# EAGLE design CommunicationBoard (EAGLE 9.6.2)
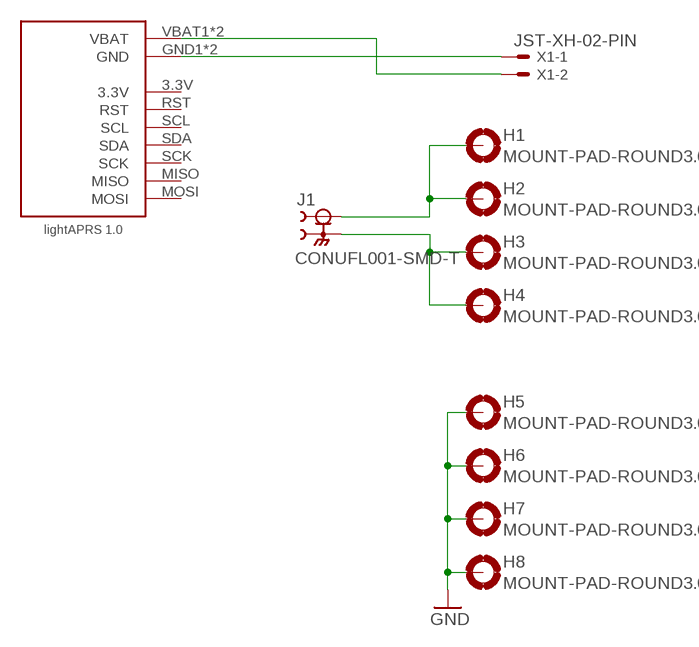
[diagram p0: schematic, sheet 1]

## Parts
H1  MOUNT-PAD-ROUND3.0  [3,0-PAD]
H2  MOUNT-PAD-ROUND3.0  [3,0-PAD]
H3  MOUNT-PAD-ROUND3.0  [3,0-PAD]
H4  MOUNT-PAD-ROUND3.0  [3,0-PAD]
H5  MOUNT-PAD-ROUND3.0  [3,0-PAD]
H6  MOUNT-PAD-ROUND3.0  [3,0-PAD]
H7  MOUNT-PAD-ROUND3.0  [3,0-PAD]
H8  MOUNT-PAD-ROUND3.0  [3,0-PAD]
J1  CONUFL001-SMD-T  [LINX_CONUFL001-SMD-T]
U$1  LIGHTAPRS  [LIGHTAPRS]
X1  JST-XH-02-PIN  [JST-XH_S2B]

## Nets
GND: H5.B3,0(MOUNT) H6.B3,0(MOUNT) H7.B3,0(MOUNT) H8.B3,0(MOUNT) U$1.GND1(GND) U$1.GND2(GND) X1.PIN1
SIG+: H1.B3,0(MOUNT) H2.B3,0(MOUNT) J1.1
SIG-: H3.B3,0(MOUNT) H4.B3,0(MOUNT) J1.2 J1.3
VBAT: U$1.VBAT1(VBAT) U$1.VBAT2(VBAT) X1.PIN2
Unconnected: U$1.3.3V U$1.MISO U$1.MOSI U$1.RST U$1.SCK U$1.SCL U$1.SDA

## Library data of the parts
H1-H8 = holes:MOUNT-PAD-ROUND: MOUNTING PAD, round
J1 = CONUFL001-SMD-T:CONUFL001-SMD-T: Check availability <https://pricing.snapeda.com/parts/CONUFL001-SMD/Linx%20Technologies/view-part?ref=eda>; AVAILABILITY: In Stock; CHECK_PRICES: https://www.snapeda.com/parts/CONUFL001-SMD/Linx+Technologies+Inc./view-part/?ref=eda; DESCRIPTION: MHF1 Straight Surface Mount Jack; MF: Linx Technologies; MP: CONUFL001-SMD; PACKAGE: None; PRICE: None; SNAPEDA_LINK: https://www.snapeda.com/parts/CONUFL001-SMD/Linx+Technologies+Inc./view-part/?ref=snap
U$1 = Breakouts:LIGHTAPRS
X1 = JST-XH Connectors:JST-XH-02-PIN: JST XH Connector 2 Pin Wire to board connector. Pitch: 2,54 mm, (0.100") Number of pins: 2 Created by Rembrandt Electronics www.rembrandtelectronics.com

## Board
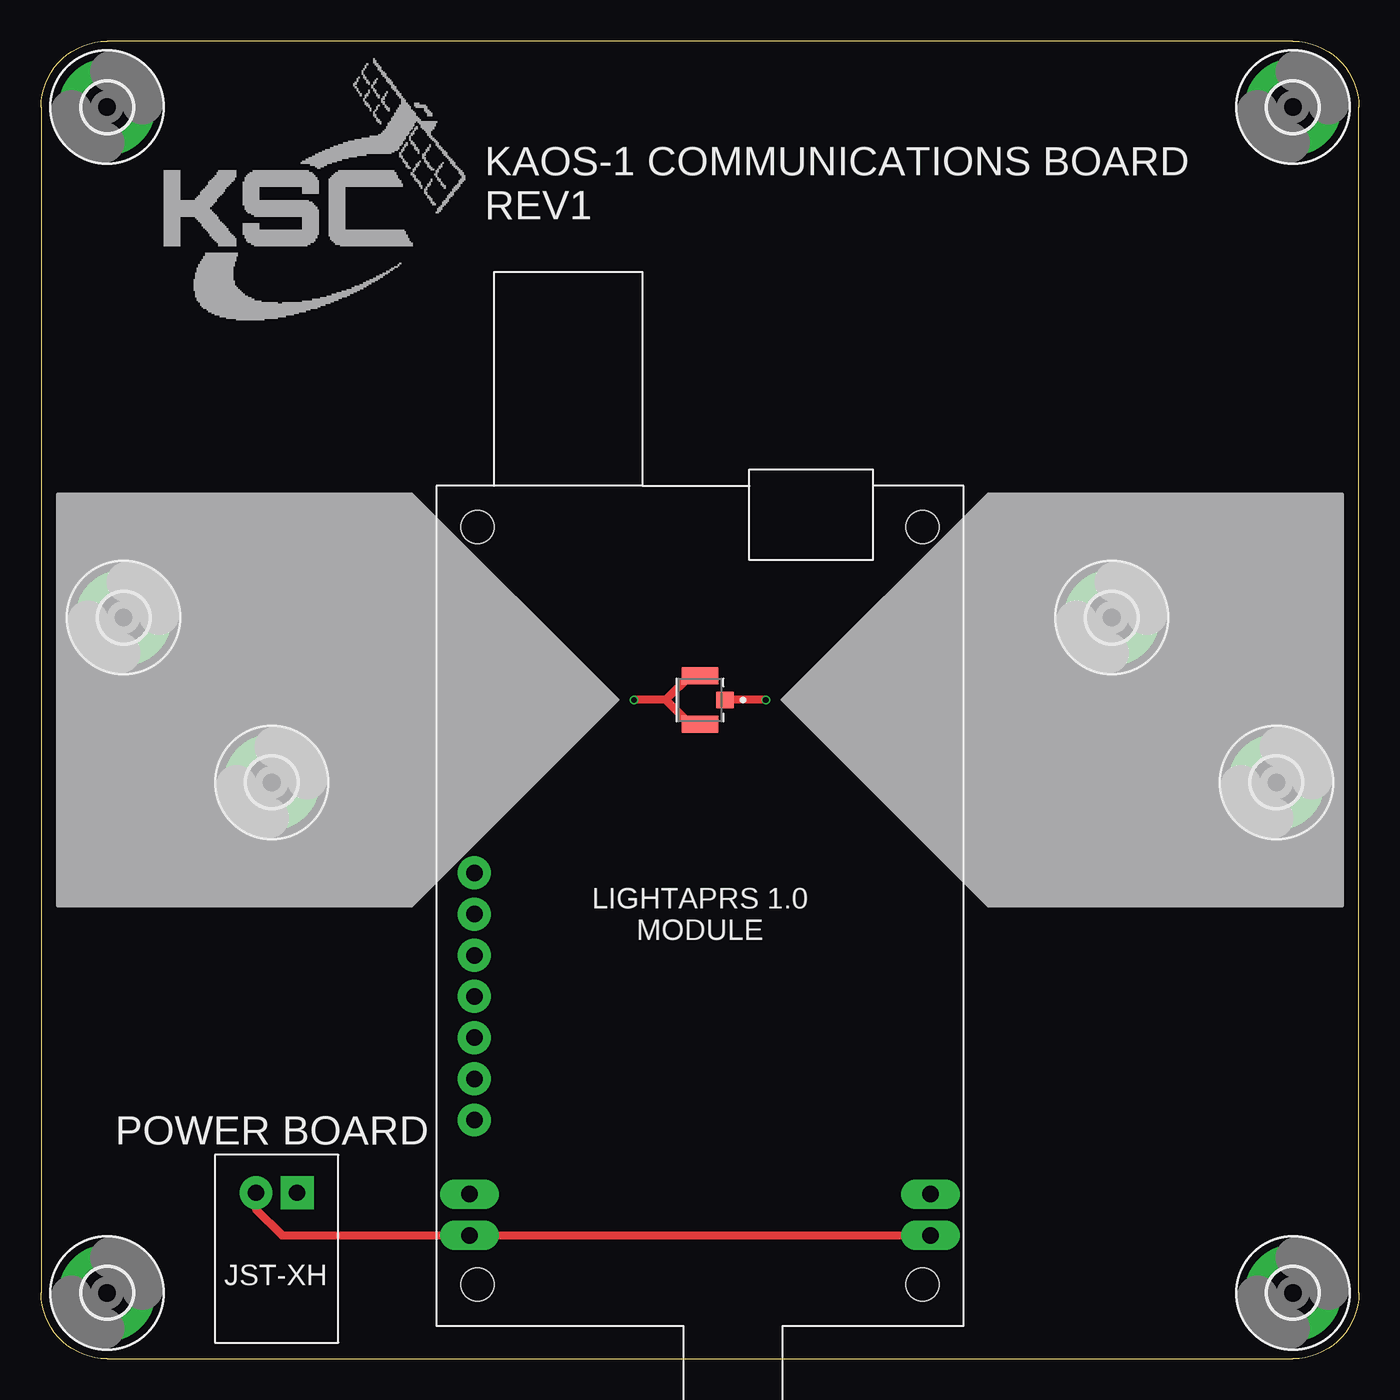
[diagram p1: board, top side]
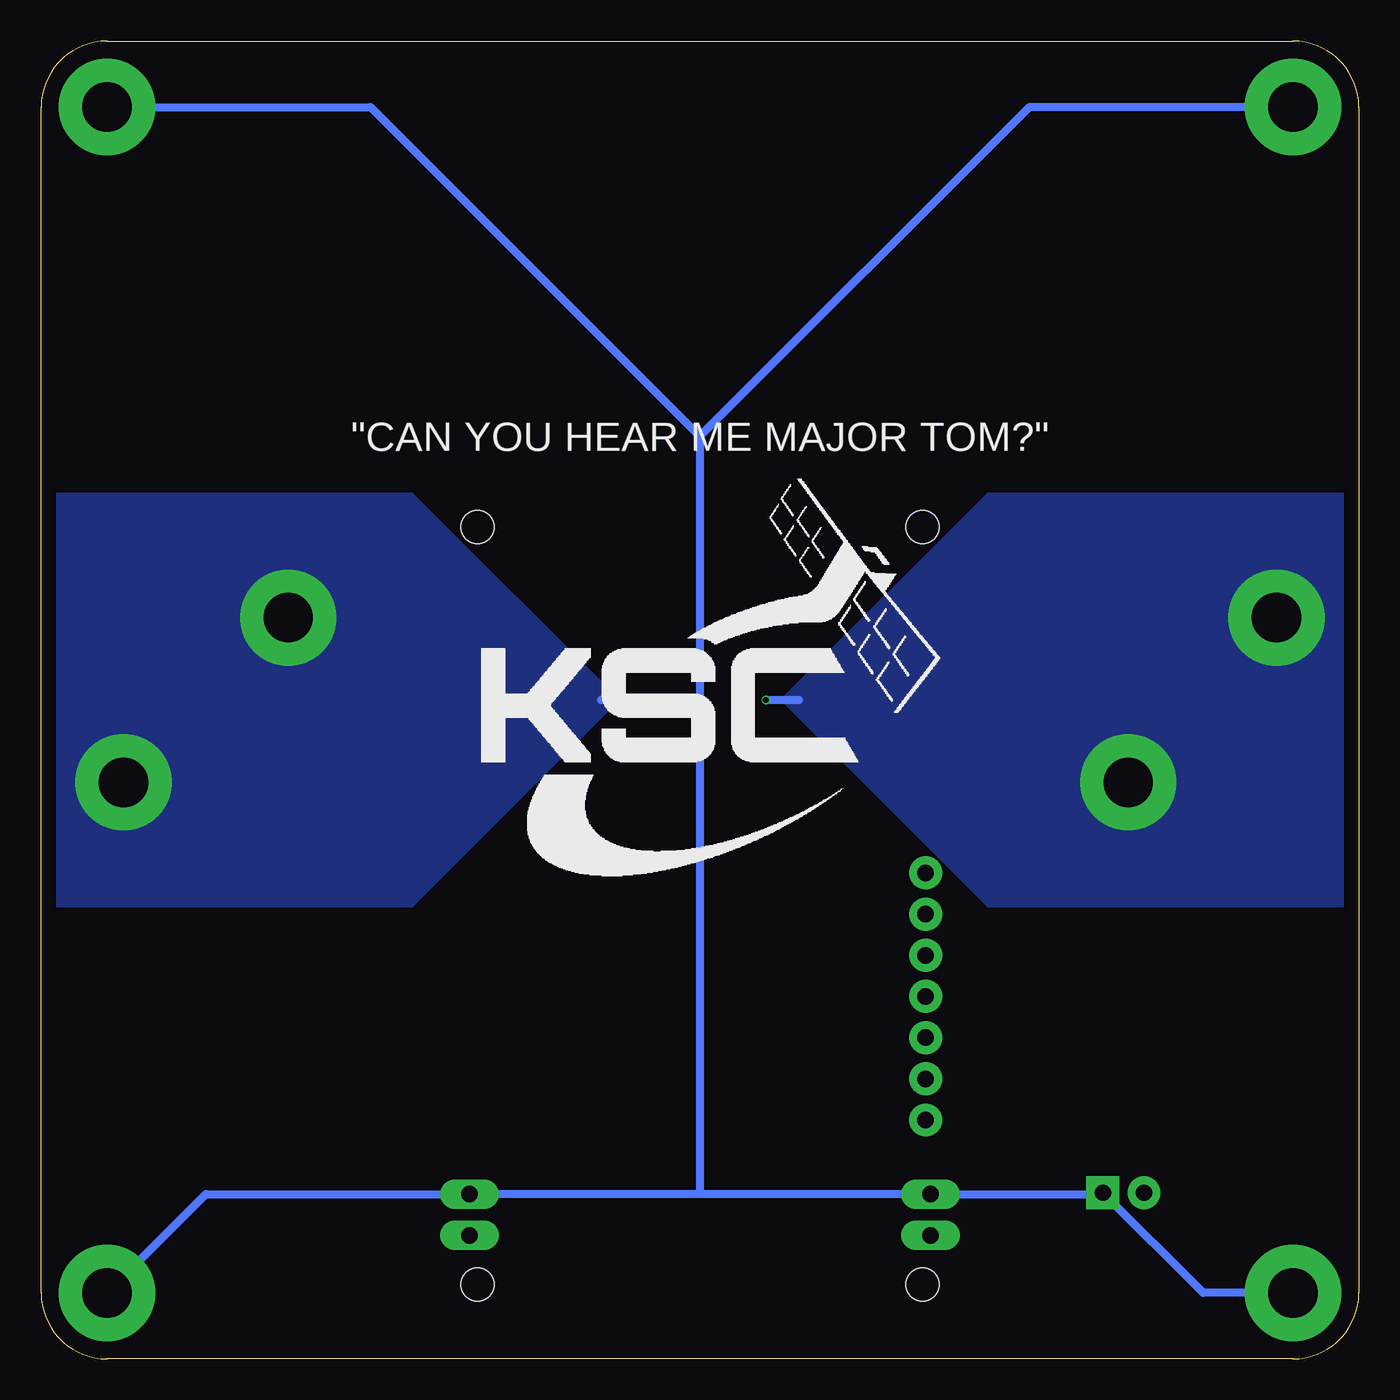
[diagram p2: board, bottom side, seen from below]

Size 80 x 80 mm. Coordinates in mm from the lower left corner, seen from the top.
Outline: 4,0 76,0 arc90 80,4 80,76 arc90 76,80 4,80 arc90 0,76 0,4 arc90 4,0
Copper layers (1*16): Top 0.035mm / dielectric 1.6mm / Bottom 0.035mm
Design rules "jlcpcb-2layers": minimum track width 5mil, minimum drill 0.3mm, track to track 5mil, track to pad 5mil, pad to pad 5mil, via to via 5mil, smd to smd 5mil, copper to edge 0.2mm, drill to drill 6mil, minimum pad ring 10mil, minimum via ring 3mil, stop-mask expansion 4mil, vias tented up to drill 0mil, thermal gap 10mil

### Footprints (pad centres in the part's own frame; a part is rotated, then mirrored left to right if it is on the bottom)
3,0-PAD = drill 3 pad 5.842: B3,0 0,0
LINX_CONUFL001-SMD-T = smd 1 x 1.05: 1 0,-1.525 | smd 1.05 x 2.2: 2 -1.475,0; 3 1.475,0
LIGHTAPRS = drill 1 pad 2: 3.3V 13.7,12.5; MISO 13.7,0; MOSI 13.7,-2.5; RST 13.7,10; SCK 13.7,2.5; SCL 13.7,7.5; SDA 13.7,5 | drill 1 long: GND1 14,17; GND2 -14,17; VBAT1 14,19.5; VBAT2 -14,19.5 | hole 2: 13.5,22.5; -13.5,22.5; -13.5,-23.5; 13.5,-23.5
JST-XH_S2B = drill 1 pad 2 square: PIN1 0,0 | drill 1 pad 2: PIN2 2.5,0

### Placement (x,y rotation side)
H1  75,35 0 top
H2  65,45 0 top
H3  14,35 0 top
H4  5,45 0 top
H5  4,4 0 top
H6  76,4 0 top
H7  76,76 0 top
H8  4,76 0 top
J1  40,40 90 top
U$1  40,27 180 top
X1  15.54,10.08 180 top

### Tracks (layer width: path | path; a pad name or v marks a point on that pad's centre or on a via)
GND
  Bottom 0.5: H5.B3,0 9.46,4 X1.PIN1 15.62,10 U$1.GND1 40,10 | H7.B3,0 60,76 40,56 | H8.B3,0 20,76 40,56 | 40,56 40,10 | 40,10 U$1.GND2 70,10 H6.B3,0
SIG+  (via drill 0.35)
  Top 0.5: v44,40 J1.1
  Bottom 0.5: v44,40 46,40
  pour Bottom (no thermals): 79,27.5 79,52.5 57.5,52.5 45,40 57.5,27.5
SIG-  (via drill 0.35)
  Top 0.5: J1.2 39.4,38.52 37.92,40 | 37.92,40 v36,40 | J1.3 39.4,41.48 37.92,40
  Bottom 0.5: v36,40 34,40
  pour Bottom (no thermals): 1,27.5 1,52.5 22.5,52.5 35,40 22.5,27.5
VBAT
  Top 0.5: X1.PIN2 13.04,9.08 14.62,7.5 U$1.VBAT1 U$1.VBAT2

### Text on the board
tPlace: KAOS-1 COMMUNICATIONS BOARD / REV1 | POWER BOARD
bPlace: "CAN YOU HEAR ME MAJOR TOM?"